# EAGLE design MiniController3HD (EAGLE 5.11)
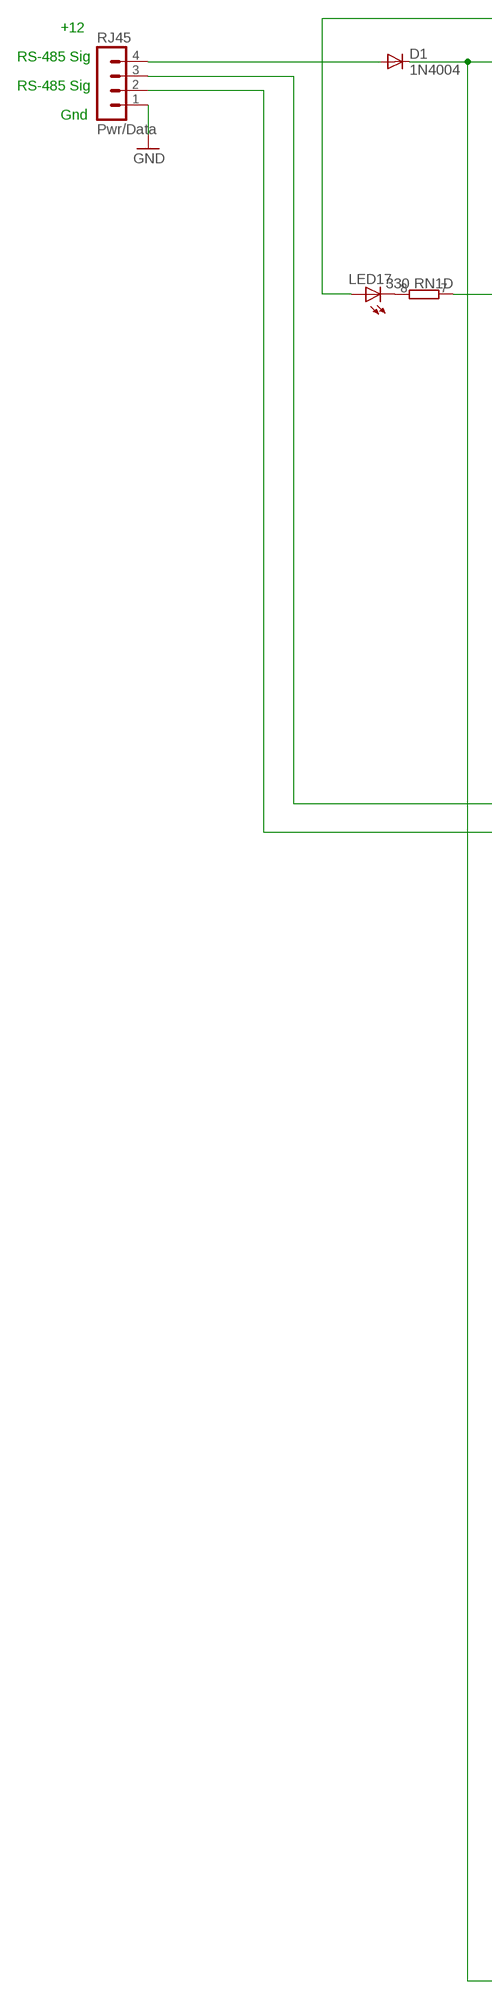
[diagram p0: schematic, sheet 1, part 1 of 2]
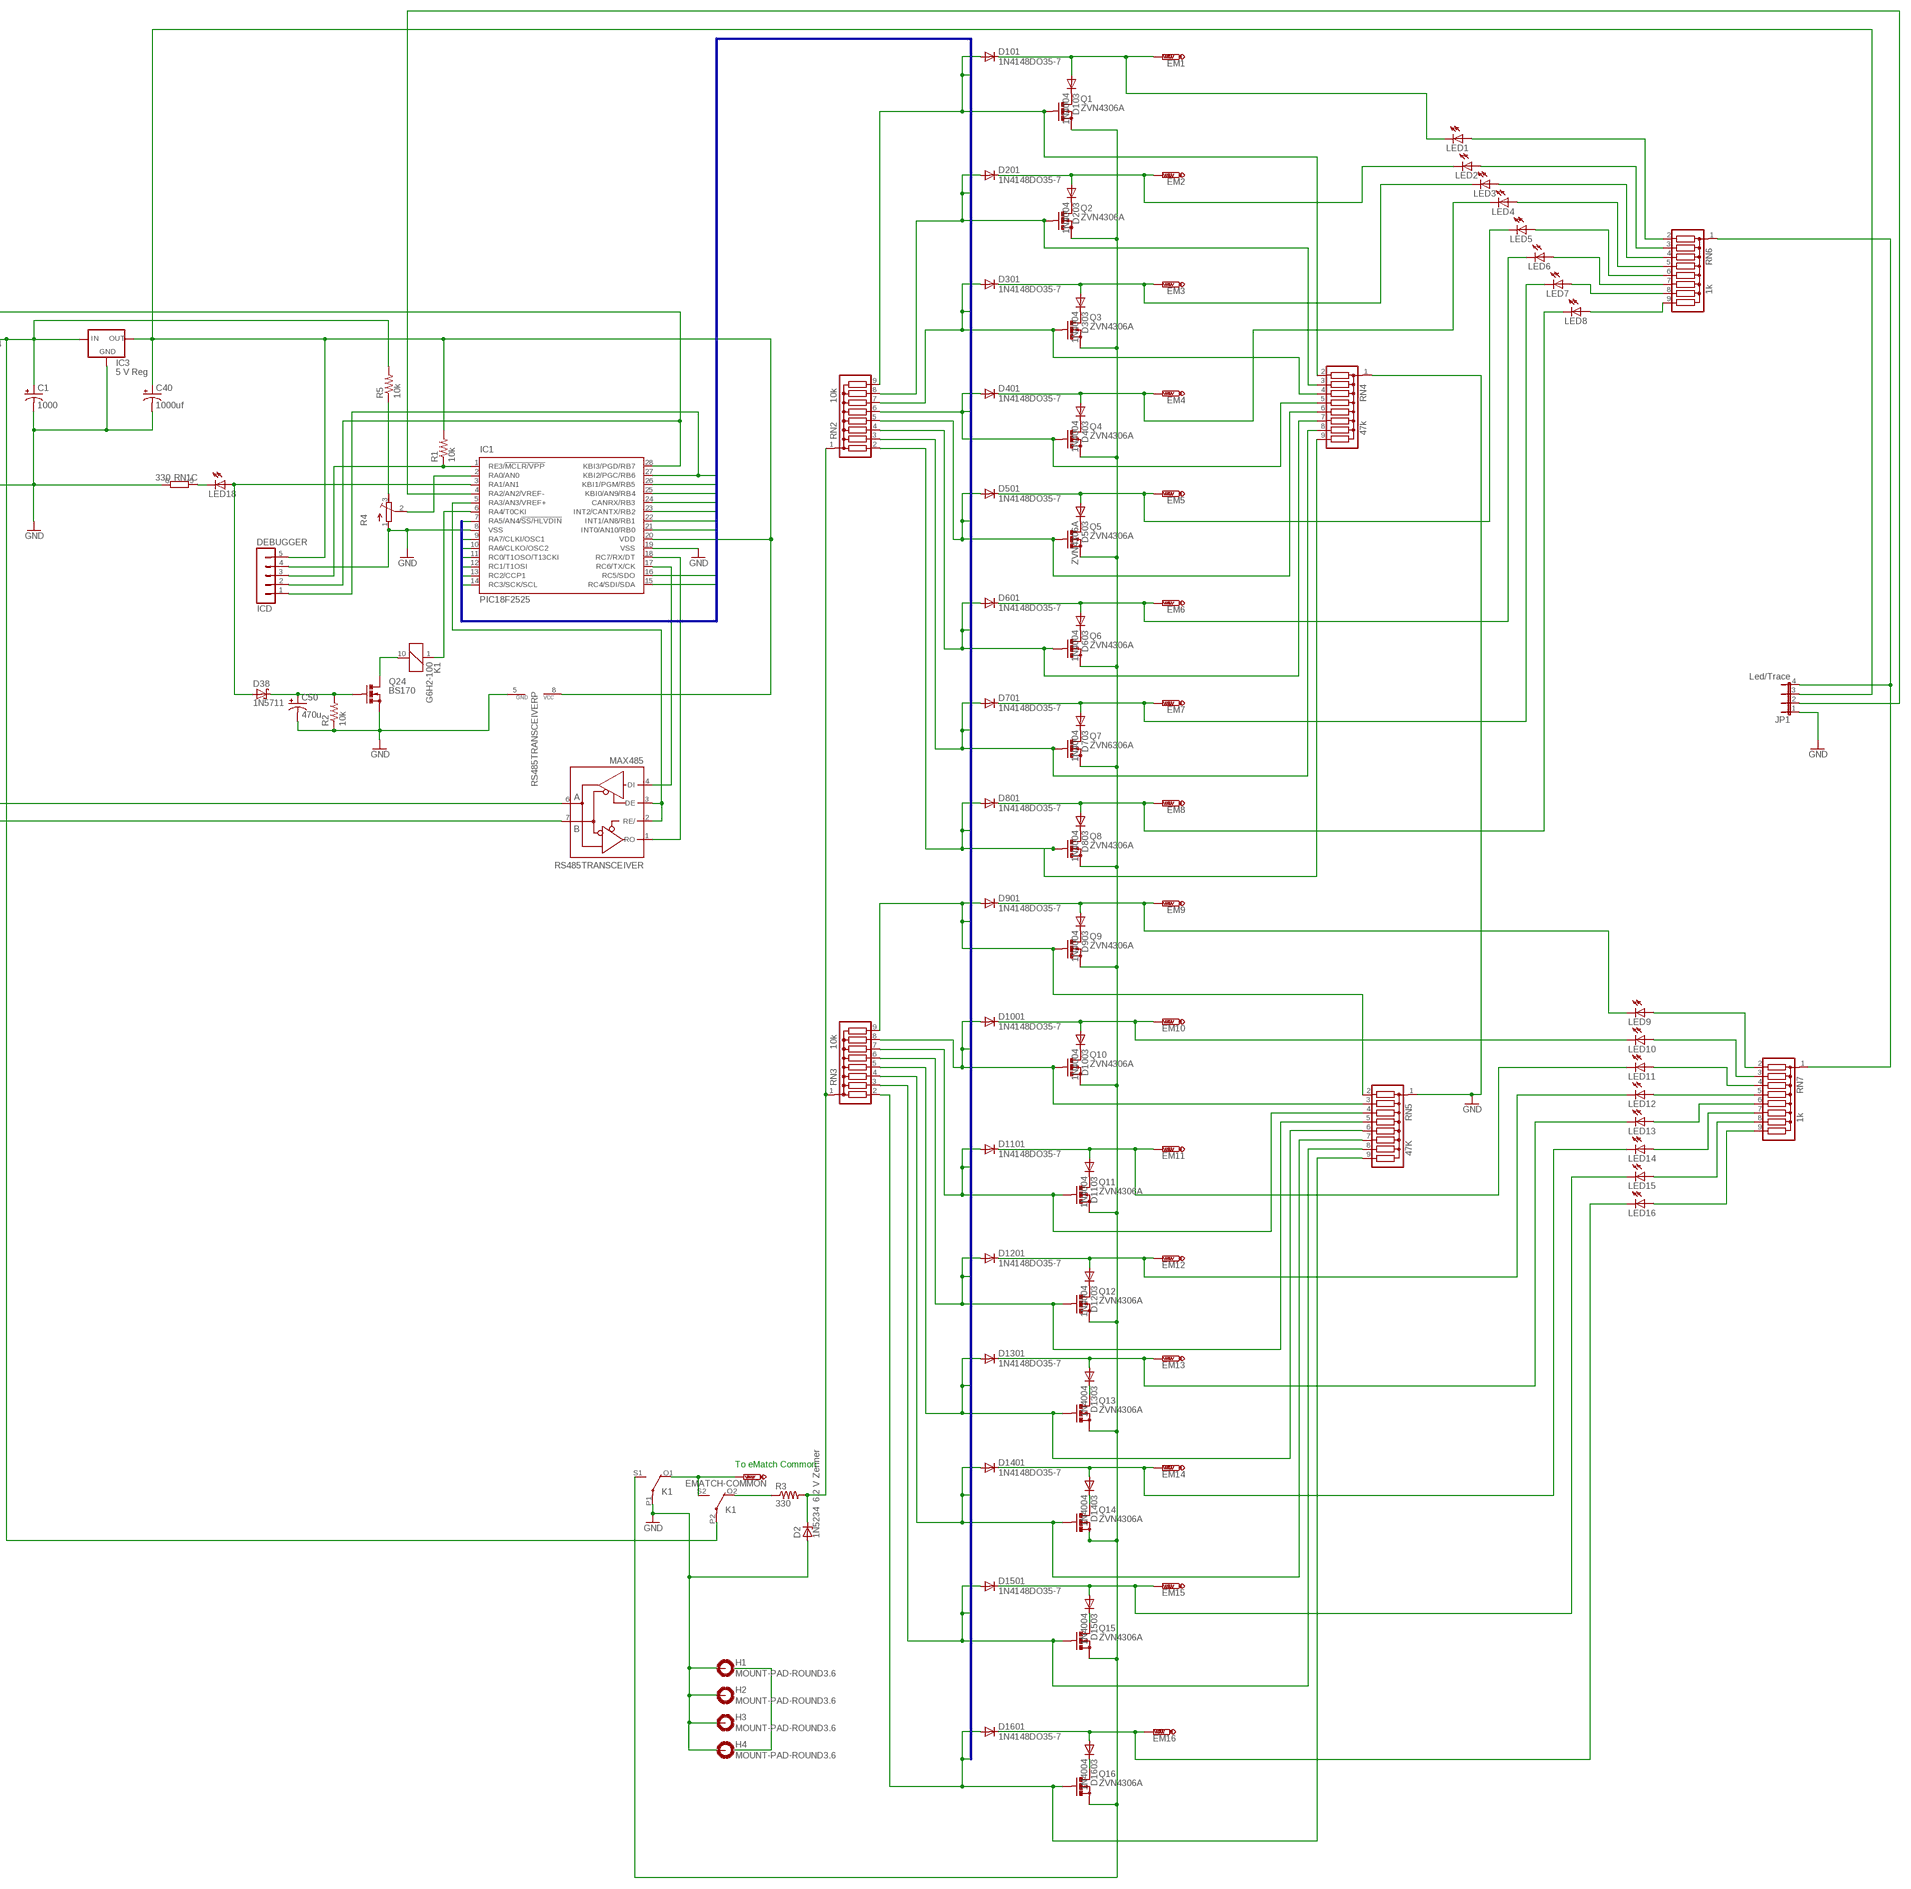
[diagram p1: schematic, sheet 1, part 2 of 2]

## Parts
C1  1000  CPOL-USE3.5-10  [E3,5-10]
C40  1000uf  CPOL-USE2.5-7  [E2,5-7]
C50  470u  CPOL-USE2.5-7  [E2,5-7]
D1  1N4004  [DO41-10]
D2  1N5234 6.2 V Zenner  1N4728  [DO41Z10]
D38  1N5711  SCHOTTKY-DIODEDO35-7  [DO35-7]
D101  1N4148DO35-7  [DO35-7]
D103  1N4004  [DO41-10]
D201  1N4148DO35-7  [DO35-7]
D203  1N4004  [DO41-10]
D301  1N4148DO35-7  [DO35-7]
D303  1N4004  [DO41-10]
D401  1N4148DO35-7  [DO35-7]
D403  1N4004  [DO41-10]
D501  1N4148DO35-7  [DO35-7]
D503  ZVN4306A  1N4004  [DO41-10]
D601  1N4148DO35-7  [DO35-7]
D603  1N4004  [DO41-10]
D701  1N4148DO35-7  [DO35-7]
D703  1N4004  [DO41-10]
D801  1N4148DO35-7  [DO35-7]
D803  1N4004  [DO41-10]
D901  1N4148DO35-7  [DO35-7]
D903  1N4004  [DO41-10]
D1001  1N4148DO35-7  [DO35-7]
D1003  1N4004  [DO41-10]
D1101  1N4148DO35-7  [DO35-7]
D1103  1N4004  [DO41-10]
D1201  1N4148DO35-7  [DO35-7]
D1203  1N4004  [DO41-10]
D1301  1N4148DO35-7  [DO35-7]
D1303  1N4004  [DO41-10]
D1401  1N4148DO35-7  [DO35-7]
D1403  1N4004  [DO41-10]
D1501  1N4148DO35-7  [DO35-7]
D1503  1N4004  [DO41-10]
D1601  1N4148DO35-7  [DO35-7]
D1603  1N4004  [DO41-10]
DEBUGGER  ICD  MA05-1  [MA05-1]
EM1  PTR1PAD1-13  [P1-13]
EM2  PTR1PAD1-13  [P1-13]
EM3  PTR1PAD1-13  [P1-13]
EM4  PTR1PAD1-13  [P1-13]
EM5  PTR1PAD1-13  [P1-13]
EM6  PTR1PAD1-13  [P1-13]
EM7  PTR1PAD1-13  [P1-13]
EM8  PTR1PAD1-13  [P1-13]
EM9  PTR1PAD1-13  [P1-13]
EM10  PTR1PAD1-13  [P1-13]
EM11  PTR1PAD1-13  [P1-13]
EM12  PTR1PAD1-13  [P1-13]
EM13  PTR1PAD1-13  [P1-13]
EM14  PTR1PAD1-13  [P1-13]
EM15  PTR1PAD1-13  [P1-13]
EM16  PTR1PAD1-13  [P1-13]
EMATCH-COMMON  PTR1PAD1-13  [P1-13]
H1  MOUNT-PAD-ROUND3.6  [3,6-PAD]
H2  MOUNT-PAD-ROUND3.6  [3,6-PAD]
H3  MOUNT-PAD-ROUND3.6  [3,6-PAD]
H4  MOUNT-PAD-ROUND3.6  [3,6-PAD]
IC1  PIC18F2525  PIC18F2580-I/SP  [DIL28-3]
IC3  5 V Reg  78LXX  [78LXX]
JP1  Led/Trace  JP4E  [JP4]
K1  G6H2-100  [G6H2-100]
LED1  LED3MM  [LED3MM]
LED2  LED3MM  [LED3MM]
LED3  LED3MM  [LED3MM]
LED4  LED3MM  [LED3MM]
LED5  LED3MM  [LED3MM]
LED6  LED3MM  [LED3MM]
LED7  LED3MM  [LED3MM]
LED8  LED3MM  [LED3MM]
LED9  LED3MM  [LED3MM]
LED10  LED3MM  [LED3MM]
LED11  LED3MM  [LED3MM]
LED12  LED3MM  [LED3MM]
LED13  LED3MM  [LED3MM]
LED14  LED3MM  [LED3MM]
LED15  LED3MM  [LED3MM]
LED16  LED3MM  [LED3MM]
LED17  LED3MM  [LED3MM]
LED18  LED3MM  [LED3MM]
Q1  ZVN4306A  BS170  [SOT54E]
Q2  ZVN4306A  BS170  [SOT54E]
Q3  ZVN4306A  BS170  [SOT54E]
Q4  ZVN4306A  BS170  [SOT54E]
Q5  ZVN4306A  BS170  [SOT54E]
Q6  ZVN4306A  BS170  [SOT54E]
Q7  ZVN6306A  BS170  [SOT54E]
Q8  ZVN4306A  BS170  [SOT54E]
Q9  ZVN4306A  BS170  [SOT54E]
Q10  ZVN4306A  BS170  [SOT54E]
Q11  ZVN4306A  BS170  [SOT54E]
Q12  ZVN4306A  BS170  [SOT54E]
Q13  ZVN4306A  BS170  [SOT54E]
Q14  ZVN4306A  BS170  [SOT54E]
Q15  ZVN4306A  BS170  [SOT54E]
Q16  ZVN4306A  BS170  [SOT54E]
Q24  BS170  [SOT54E]
R1  10k  R-US_0204/7  [0204/7]
R2  10k  R-US_0204/7  [0204/7]
R3  330  R-US_0204/7  [0204/7]
R4  R-TRIMM64W  [RTRIM64W]
R5  10k  R-US_0204/7  [0204/7]
RJ45  Pwr/Data  MA04-1  [MA04-1]
RN1  330  E4R  [SIL8]
RN2  10k  G08R  [SIL9]
RN3  10k  G08R  [SIL9]
RN4  47k  G08R  [SIL9]
RN5  47K  G08R  [SIL9]
RN6  1k  G08R  [SIL9]
RN7  1k  G08R  [SIL9]
RS485TRANSCEIVER  MAX485  MAX481CPA  [DIL08]

## Nets
CUE1: D101.A IC1.7(RA5/AN4/!SS/HLVDIN) Q1.G RN2.9 RN4.2
CUE2: D201.A IC1.9(RA7/CLKI/OSC1) Q2.G RN2.8 RN4.3
CUE3: D301.A IC1.10(RA6/CLKO/OSC2) Q3.G RN2.7 RN4.4
CUE4: D401.A IC1.11(RC0/T1OSO/T13CKI) Q4.G RN2.6 RN4.5
CUE5: D501.A IC1.12(RC1/T1OSI) Q5.G RN2.5 RN4.6
CUE6: D601.A IC1.13(RC2/CCP1) Q6.G RN2.4 RN4.7
CUE7: D701.A IC1.14(RC3/SCK/SCL) Q7.G RN2.3 RN4.8
CUE8: D801.A IC1.15(RC4/SDI/SDA) Q8.G RN2.2 RN4.9
CUE9: D901.A IC1.16(RC5/SDO) Q9.G RN3.9 RN5.2
CUE10: D1001.A IC1.21(INT0/AN10/RB0) Q10.G RN3.8 RN5.3
CUE11: D1101.A IC1.22(INT1/AN8/RB1) Q11.G RN3.7 RN5.4
CUE12: D1201.A IC1.23(INT2/CANTX/RB2) Q12.G RN3.6 RN5.5
CUE13: D1301.A IC1.24(CANRX/RB3) Q13.G RN3.5 RN5.6
CUE14: D1401.A IC1.25(KBI0/AN9/RB4) Q14.G RN3.4 RN5.7
CUE15: D1501.A IC1.26(KBI1/PGM/RB5) Q15.G RN3.3 RN5.8
CUE16: D1601.A DEBUGGER.1 IC1.27(KBI2/PGC/RB6) Q16.G RN3.2 RN5.9
GND [GND]: C1.- C40.- C50.- D2.A DEBUGGER.4 H1.B3,6(MOUNT) H2.B3,6(MOUNT) H3.B3,6(MOUNT) H4.B3,6(MOUNT) IC1.8(VSS) IC1.19(VSS) IC3.GND JP1.1 K1.P1(2:P) Q24.S R2.1 R4.1(E) RJ45.1 RN1.6 RN1.7 RN4.1 RN5.1 RS485TRANSCEIVER.5(GND)
N$1 [Pwr]: C1.+ D1.C IC3.IN K1.P2(3:P) R5.2
N$2 [GND]: K1.S1(2:S) Q1.S Q2.S Q3.S Q4.S Q5.S Q6.S Q7.S Q8.S Q9.S Q10.S Q11.S Q12.S Q13.S Q14.S Q15.S Q16.S
N$3: RJ45.3 RS485TRANSCEIVER.6(A)
N$4: RJ45.2 RS485TRANSCEIVER.7(B)
N$5: C50.+ D38.C Q24.G R2.2
N$6: IC1.18(RC7/RX/DT) RS485TRANSCEIVER.1(RO)
N$7: IC1.17(RC6/TX/CK) RS485TRANSCEIVER.4(DI)
N$8: LED17.K(C) RN1.8
N$9: IC1.6(RA4/T0CKI) K1.1
N$10 [Pwr]: D1.A RJ45.4
N$11: DEBUGGER.3 IC1.1(RE3/!MCLR/VPP) R1.1
N$12: D103.C Q1.D
N$13: LED18.K(C) RN1.5
N$14: DEBUGGER.2 IC1.28(KBI3/PGD/RB7) LED17.A
N$15: D203.C Q2.D
N$16: D303.C Q3.D
N$17: D403.C Q4.D
N$18: D503.C Q5.D
N$19: D603.C Q6.D
N$20: D703.C Q7.D
N$21: D803.C Q8.D
N$22: D903.C Q9.D
N$23: D1003.C Q10.D
N$24: D1103.C Q11.D
N$25: D1203.C Q12.D
N$26: IC1.2(RA0/AN0) R4.2(S)
N$27: IC1.4(RA2/AN2/VREF-) JP1.2
N$28: R4.3(A) R5.1
N$38: D101.C D103.A EM1.TP LED1.K(C)
N$39: D201.C D203.A EM2.TP LED2.K(C)
N$40: D301.C D303.A EM3.TP LED3.K(C)
N$41: D401.C D403.A EM4.TP LED4.K(C)
N$42: D501.C D503.A EM5.TP LED5.K(C)
N$43: D601.C D603.A EM6.TP LED6.K(C)
N$44: D701.C D703.A EM7.TP LED7.K(C)
N$45: D801.C D803.A EM8.TP LED8.K(C)
N$46: D901.C D903.A EM9.TP LED9.K(C)
N$47: D1001.C D1003.A EM10.TP LED10.K(C)
N$48: D1101.C D1103.A EM11.TP LED11.K(C)
N$49: K1.O2(3:O) R3.1
N$50: K1.10 Q24.D
N$51 [Pwr]: EMATCH-COMMON.TP K1.O1(2:O) K1.S2(3:S)
N$53: IC1.5(RA3/AN3/VREF+) RS485TRANSCEIVER.2(RE/) RS485TRANSCEIVER.3(DE)
N$54: D1303.C Q13.D
N$55: D1403.C Q14.D
N$56: D1503.C Q15.D
N$57: D1603.C Q16.D
N$62: D1601.C D1603.A EM16.TP LED16.K(C)
N$63: LED8.A RN6.9
N$64: LED7.A RN6.8
N$65: D38.A IC1.3(RA1/AN1) LED18.A
N$67: LED6.A RN6.7
N$68: LED5.A RN6.6
N$69: LED4.A RN6.5
N$70: LED3.A RN6.4
N$71: LED2.A RN6.3
N$72: LED1.A RN6.2
N$73: D2.C R3.2 RN2.1 RN3.1
N$74: D1501.C D1503.A EM15.TP LED15.K(C)
N$75: LED9.A RN7.2
N$76: LED10.A RN7.3
N$77: LED11.A RN7.4
N$78: LED12.A RN7.5
N$79: LED13.A RN7.6
N$80: LED14.A RN7.7
N$81: LED15.A RN7.8
N$82: LED16.A RN7.9
N$83: JP1.4 RN6.1 RN7.1
N$84: D1301.C D1303.A EM13.TP LED13.K(C)
N$85: D1401.C D1403.A EM14.TP LED14.K(C)
N$86: D1201.C D1203.A EM12.TP LED12.K(C)
VDD: C40.+ DEBUGGER.5 IC1.20(VDD) IC3.OUT JP1.3 R1.2 RS485TRANSCEIVER.8(VCC)
Unconnected: RN1.1 RN1.2 RN1.3 RN1.4

## Buses
CUE[1..16]

## Notes on the sheet
- +12
- RS-485 Sig
- RS-485 Sig
- Gnd
- To eMatch Common

## Library data of the parts
C1 C40 C50 = rcl:CPOL-US: POLARIZED CAPACITOR, American symbol
D1 D103 D203 D303 D403 D503 D603 D703 D803 D903 D1003 D1103 D1203 D1303 D1403 D1503 D1603 = diode:1N4004: DIODE general purpose rectifier, 1 A
D2 = diode:1N4728: Z DIODE 3.3 V, 1W, 5 percent
D38 = diode:SCHOTTKY-DIODE: Schottky Diode
D101 D201 D301 D401 D501 D601 D701 D801 D901 D1001 D1101 D1201 D1301 D1401 D1501 D1601 = diode:1N4148: DIODE high speed (Philips)
DEBUGGER = con-lstb:MA05-1: PIN HEADER; OC_FARNELL: unknown; OC_NEWARK: unknown
EM1-EM16 EMATCH-COMMON = testpad:PTR1: TEST PIN
H1-H4 = holes:MOUNT-PAD-ROUND: MOUNTING PAD, round
IC1 = microchip:PIC18F2*80: 28-Pin Enhanced Flash Microcontrollers with ECAN(TM) Technology 10-Bit A/D and nanoWatt Technology Source: http://www.microchip.com .. 39637a.pdf
IC3 = v-reg:78LXX: VOLTAGE REGULATOR
JP1 = jumper:JP4E: JUMPER
K1 = Cranwell:G6H2-100: RELAY 2 x switch, 0.5 A/125 V AC, 1 A/30 V DC, Omron
LED1-LED18 = led:LED: LED OSRAM: - CHIPLED LG R971, LG N971, LY N971, LG Q971, LY Q971, LO R971, LY R971 LH N974, LH R974 LS Q976, LO Q976, LY Q976 LO Q996 - Hyper CHIPLED LW Q18S LB Q993, LB Q99A, LB R99A - SideLED LS A670, LO A670, LY A670, LG A670, LP A670 LB A673, LV A673, LT A673, LW A673 LH A674 LY A675 LS A676, LA A676, LO A676, LY A676, LW A676 LS A679, LY A679, LG A679 - Hyper Micro SIDELED® LS Y876, LA Y876, LO Y876, LY Y876 LT Y87S - SmartLED LW L88C, LW L88S LB L89C, LB L89S, LG L890 LS L89K, LO L89K, LY L89K LS L896, LA L896, LO L896, LY L896 - TOPLED LS T670, LO T670, LY T670, LG T670, LP T670 LSG T670, LSP T670, LSY T670, LOP T670, LYG T670 LG T671, LOG T671, LSG T671 LB T673, LV T673, LT T673, LW T673 LH T674 LS T676, LA T676, LO T676, LY T676, LB T676, LH T676, LSB T676, LW T676 LB T67C, LV T67C, LT T67C, LS T67K, LO T67K, LY T67K, LW E67C LS E67B, LA E67B, LO E67B, LY E67B, LB E67C, LV E67C, LT E67C LW T67C LS T679, LY T679, LG T679 LS T770, LO T770, LY T770, LG T770, LP T770 LB T773, LV T773, LT T773, LW T773 LH T774 LS E675, LA E675, LY E675, LS T675 LS T776, LA T776, LO T776, LY T776, LB T776 LHGB T686 LT T68C, LB T68C - Hyper Mini TOPLED® LB M676 - Mini TOPLED Santana® LG M470 LS M47K, LO M47K, LY M47K Source: http://www.osram.convergy.de LUXEON: - LUMILED® LXK2-PW12-R00, LXK2-PW12-S00, LXK2-PW14-U00, LXK2-PW14-V00 LXK2-PM12-R00, LXK2-PM12-S00, LXK2-PM14-U00 LXK2-PE12-Q00, LXK2-PE12-R00, LXK2-PE12-S00, LXK2-PE14-T00, LXK2-PE14-U00 LXK2-PB12-K00, LXK2-PB12-L00, LXK2-PB12-M00, LXK2-PB14-N00, LXK2-PB14-P00, LXK2-PB14-Q00 LXK2-PR12-L00, LXK2-PR12-M00, LXK2-PR14-Q00, LXK2-PR14-R00 LXK2-PD12-Q00, LXK2-PD12-R00, LXK2-PD12-S00 LXK2-PH12-R00, LXK2-PH12-S00 LXK2-PL12-P00, LXK2-PL12-Q00, LXK2-PL12-R00 Source: www.luxeon.com KINGBRIGHT: KA-3528ASYC Source: www.kingbright.com
Q1-Q16 Q24 = transistor-small-signal:BS170: N-CHANNEL MOS FET
R1-R3 R5 = rcl:R-US_: RESISTOR, American symbol
R4 = rcl:R-TRIMM: Trimm resistor
RJ45 = con-lstb:MA04-1: PIN HEADER
RN1 = resistor-sil:E4R: SIL RESISTOR
RN2-RN7 = resistor-sil:G08R: SIL RESISTOR
RS485TRANSCEIVER = maxim:MAX481CPA: RS485 TRANSEIVER

## Net classes
1 GND: width 0.61 mm
2 Pwr: width 0.61 mm

## Board
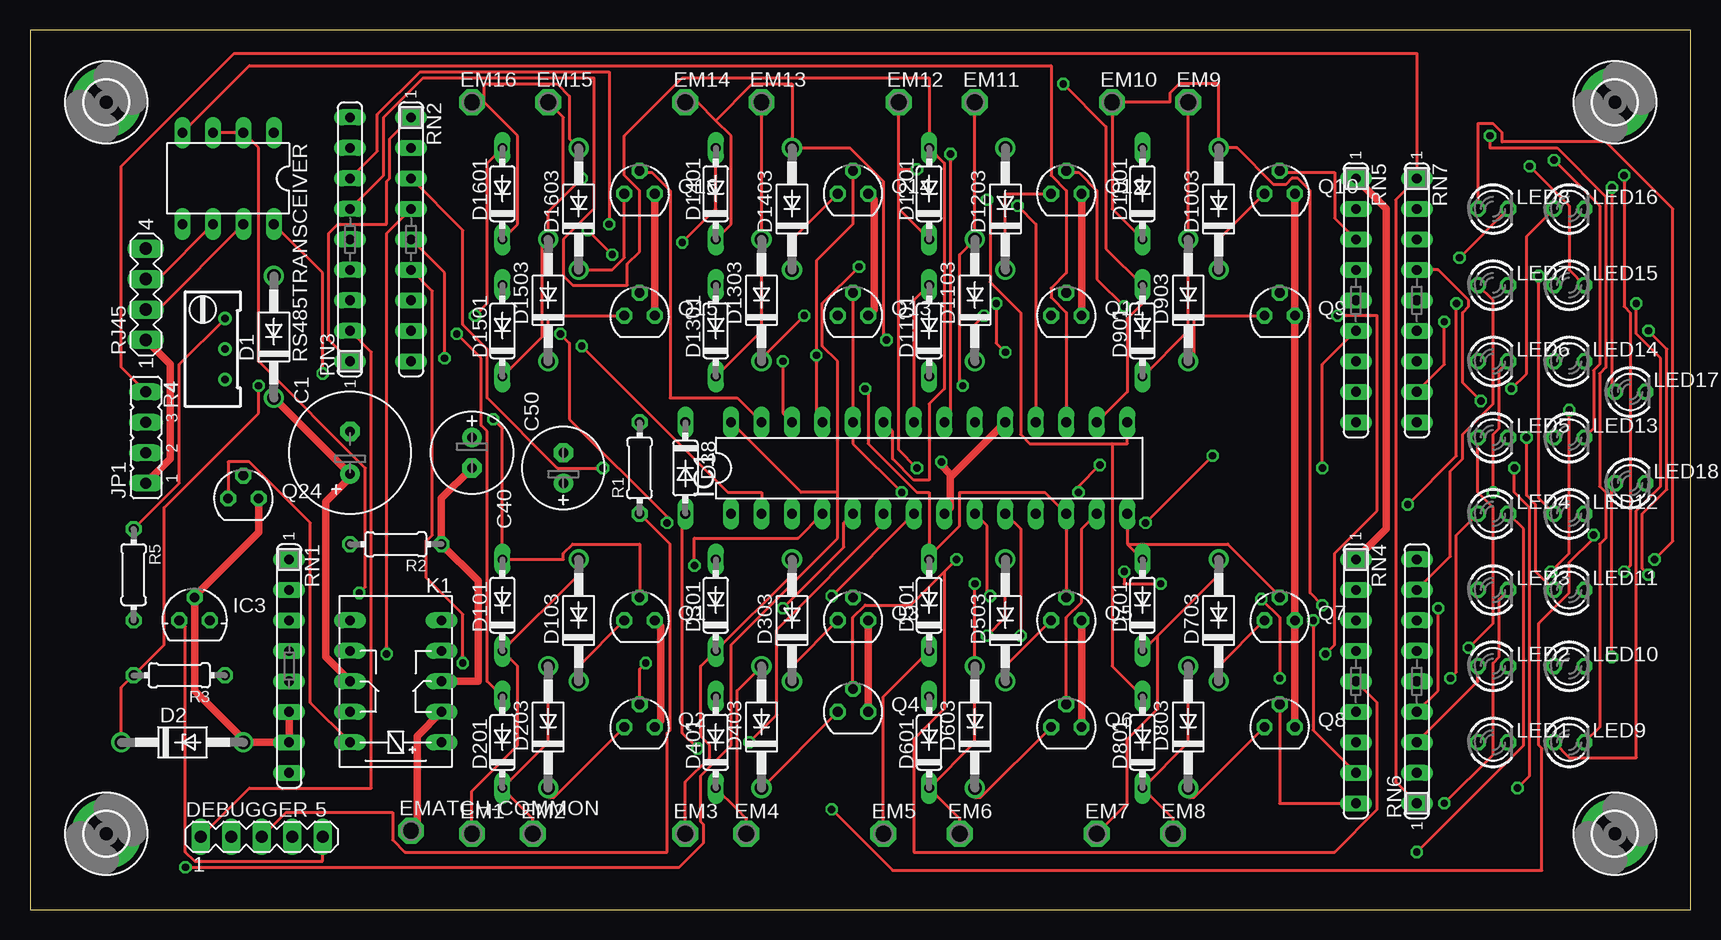
[diagram p2: board, top side]
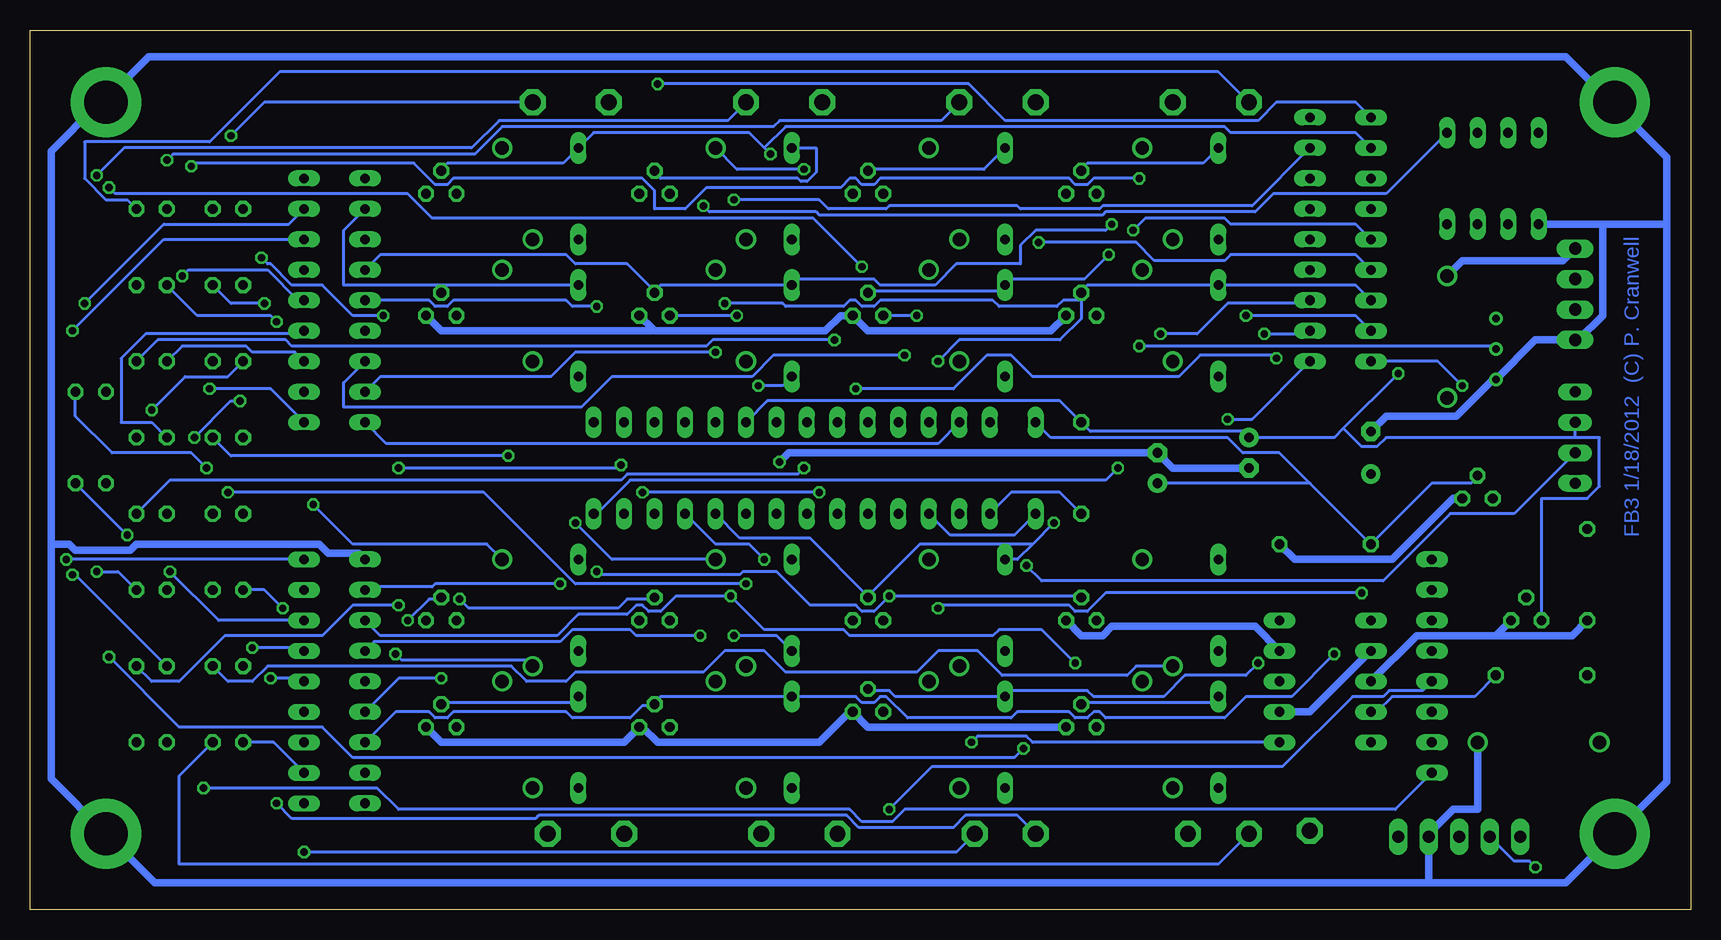
[diagram p3: board, bottom side, seen from below]

Size 138.41 x 73.33 mm. Coordinates in mm from the lower left corner, seen from the top.
Outline: 0,0 138.41,0 138.41,73.33 0,73.33 0,0
Copper layers (1*16): Top 0.035mm / dielectric 1.5mm / Bottom 0.035mm
Design rules "default *": minimum track width 10mil, minimum drill 24mil, track to track 10mil, track to pad 10mil, pad to pad 10mil, via to via 10mil, smd to smd 8mil, copper to edge 40mil, drill to drill 10mil, minimum pad ring 10mil, minimum via ring 8mil, stop-mask expansion 4mil, vias tented up to drill 0mil, thermal gap 10mil

### Footprints (pad centres in the part's own frame; a part is rotated, then mirrored left to right if it is on the bottom)
E3,5-10 = drill 0.813 pad 1.6 round: + -1.778,0 | drill 0.813 pad 1.6 octagon: - 1.778,0
E2,5-7 = drill 0.813 pad 1.6 round: + -1.27,0 | drill 0.813 pad 1.6 octagon: - 1.27,0
DO41-10 = drill 1.118 round: A 5.08,0; C -5.08,0
DO41Z10 = drill 1.118 round: A 5.08,0; C -5.08,0
DO35-7 = drill 0.813 long: A 3.81,0; C -3.81,0
MA05-1 = drill 1.016 long: 1 -5.08,0; 2 -2.54,0; 3 0,0; 4 2.54,0; 5 5.08,0
P1-13 = drill 1.321 pad 2.159 octagon: TP 0,0
3,6-PAD = drill 3.6 pad 5.842 round: B3,6 0,0
DIL28-3 = drill 0.813 long: 1 -16.51,-3.81; 2 -13.97,-3.81; 3 -11.43,-3.81; 4 -8.89,-3.81; 5 -6.35,-3.81; 6 -3.81,-3.81; 7 -1.27,-3.81; 8 1.27,-3.81; 9 3.81,-3.81; 10 6.35,-3.81; 11 8.89,-3.81; 12 11.43,-3.81; 13 13.97,-3.81; 14 16.51,-3.81; 15 16.51,3.81; 16 13.97,3.81; 17 11.43,3.81; 18 8.89,3.81; 19 6.35,3.81; 20 3.81,3.81; 21 1.27,3.81; 22 -1.27,3.81; 23 -3.81,3.81; 24 -6.35,3.81; 25 -8.89,3.81; 26 -11.43,3.81; 27 -13.97,3.81; 28 -16.51,3.81
78LXX = drill 0.813 octagon: GND 0,1.905; IN 1.27,0; OUT -1.27,0
JP4 = drill 0.914 long: 1 -3.81,0; 2 -1.27,0; 3 1.27,0; 4 3.81,0
G6H2-100 = drill 0.813 long: 1 -5.08,-3.81; 5 5.08,-3.81; 6 5.08,3.81; 10 -5.08,3.81; O1 -2.54,-3.81; O2 -2.54,3.81; P1 0,-3.81; P2 0,3.81; S1 2.54,-3.81; S2 2.54,3.81
LED3MM = drill 0.813 octagon: A -1.27,0; K 1.27,0
SOT54E = drill 0.813 octagon: D -1.27,0; G 0,1.905; S 1.27,0
0204/7 = drill 0.813 octagon: 1 -3.81,0; 2 3.81,0
RTRIM64W = drill 0.61 round: 1 1.27,-2.54; 2 1.27,0; 3 1.27,2.54
MA04-1 = drill 1.016 long: 1 -3.81,0; 2 -1.27,0; 3 1.27,0; 4 3.81,0
SIL8 = drill 0.813 long: 1 -8.89,0; 2 -6.35,0; 3 -3.81,0; 4 -1.27,0; 5 1.27,0; 6 3.81,0; 7 6.35,0; 8 8.89,0
SIL9 = drill 0.813 long: 1 -10.16,0; 2 -7.62,0; 3 -5.08,0; 4 -2.54,0; 5 0,0; 6 2.54,0; 7 5.08,0; 8 7.62,0; 9 10.16,0
DIL08 = drill 0.813 long: 1 -3.81,-3.81; 2 -1.27,-3.81; 3 1.27,-3.81; 4 3.81,-3.81; 5 3.81,3.81; 6 1.27,3.81; 7 -1.27,3.81; 8 -3.81,3.81

### Placement (x,y rotation side)
C1  26.67,38.1 90 top
C40  36.83,38.1 270 top
C50  44.45,36.83 90 top
D1  20.32,47.75 90 top
D2  12.7,13.97 0 top
D38  54.61,36.83 270 top
D101  39.37,25.4 90 top
D103  45.72,24.13 90 top
D201  39.37,13.97 90 top
D203  43.18,15.24 90 top
D301  57.15,25.4 90 top
D303  63.5,24.13 90 top
D401  57.15,13.97 90 top
D403  60.96,15.24 90 top
D501  74.93,25.4 90 top
D503  81.28,24.13 90 top
D601  74.93,13.97 90 top
D603  78.74,15.24 90 top
D701  92.71,25.4 90 top
D703  99.06,24.13 90 top
D801  92.71,13.97 90 top
D803  96.52,15.24 90 top
D901  92.71,48.26 90 top
D903  96.52,50.8 90 top
D1001  92.71,59.69 90 top
D1003  99.06,58.42 90 top
D1101  74.93,48.26 90 top
D1103  78.74,50.8 90 top
D1201  74.93,59.69 90 top
D1203  81.28,58.42 90 top
D1301  57.15,48.26 90 top
D1303  60.96,50.8 90 top
D1401  57.15,59.69 90 top
D1403  63.5,58.42 90 top
D1501  39.37,48.26 90 top
D1503  43.18,50.8 90 top
D1601  39.37,59.69 90 top
D1603  45.72,58.42 90 top
DEBUGGER  19.3,6.1 0 top
EM1  36.83,6.35 0 top
EM2  41.91,6.35 0 top
EM3  54.61,6.35 0 top
EM4  59.69,6.35 0 top
EM5  71.12,6.35 0 top
EM6  77.47,6.35 0 top
EM7  88.9,6.35 0 top
EM8  95.25,6.35 0 top
EM9  96.52,67.31 0 top
EM10  90.17,67.31 0 top
EM11  78.74,67.31 0 top
EM12  72.39,67.31 0 top
EM13  60.96,67.31 0 top
EM14  54.61,67.31 0 top
EM15  43.18,67.31 0 top
EM16  36.83,67.31 0 top
EMATCH-COMMON  31.75,6.6 0 top
H1  6.35,6.35 0 top
H2  6.35,67.31 0 top
H3  132.08,67.31 0 top
H4  132.08,6.35 0 top
IC1  74.93,36.83 0 top
IC3  13.72,24.13 0 top
JP1  9.65,39.37 90 top
K1  30.48,19.05 90 top
LED1  121.92,13.97 0 top
LED2  121.92,20.32 0 top
LED3  121.92,26.67 0 top
LED4  121.92,33.02 0 top
LED5  121.92,39.37 0 top
LED6  121.92,45.72 0 top
LED7  121.92,52.07 0 top
LED8  121.92,58.42 0 top
LED9  128.27,13.97 0 top
LED10  128.27,20.32 0 top
LED11  128.27,26.67 0 top
LED12  128.27,33.02 0 top
LED13  128.27,39.37 0 top
LED14  128.27,45.72 0 top
LED15  128.27,52.07 0 top
LED16  128.27,58.42 0 top
LED17  133.35,43.18 0 top
LED18  133.35,35.56 0 top
Q1  50.8,24.13 0 top
Q2  50.8,15.24 0 top
Q3  68.58,24.13 0 top
Q4  68.58,16.51 0 top
Q5  86.36,24.13 0 top
Q6  86.36,15.24 0 top
Q7  104.14,24.13 0 top
Q8  104.14,15.24 0 top
Q9  104.14,49.53 0 top
Q10  104.14,59.69 0 top
Q11  86.36,49.53 0 top
Q12  86.36,59.69 0 top
Q13  68.58,49.53 0 top
Q14  68.58,59.69 0 top
Q15  50.8,49.53 0 top
Q16  50.8,59.69 0 top
Q24  17.78,34.29 0 top
R1  50.8,36.83 90 top
R2  30.48,30.48 180 top
R3  12.45,19.56 180 top
R4  14.99,46.74 0 top
R5  8.64,27.94 270 top
RJ45  9.65,51.31 90 top
RN1  21.59,20.32 270 top
RN2  31.75,55.88 270 top
RN3  26.67,55.88 90 top
RN4  110.49,19.05 270 top
RN5  110.49,50.8 270 top
RN6  115.57,19.05 90 top
RN7  115.57,50.8 270 top
RS485TRANSCEIVER  16.51,60.96 180 top

### Tracks (layer width: path | path; a pad name or v marks a point on that pad's centre or on a via)
CUE1  (via drill 0.61)
  Top 0.254: Q1.G 50.8,30.48 45.21,30.48 44.45,29.72 44.45,29.21 D101.A 39.37,40.13 v38.61,40.89 | v66.8,26.16 IC1.7 | v94.23,27.18 91.19,27.18 v91.19,28.19
  Bottom 0.254: RN2.9 36.58,40.89 v38.61,40.89 | Q1.G 50.8,26.16 v66.8,26.16 68.07,24.89 69.09,24.89 69.6,25.4 73.41,25.4 76.2,28.19 78.99,28.19 79.25,27.94 90.93,27.94 v91.19,28.19 | RN4.2 110.24,26.92 104.9,26.92 104.65,27.18 v94.23,27.18
CUE2  (via drill 0.61)
  Top 0.254: v80.01,26.16 79.76,26.42 79.76,32 IC1.9 | v35.56,48.01 37.59,45.97 37.59,40.39 38.1,39.88 38.1,19.05 D201.A | v51.31,20.57 50.8,20.07 Q2.G
  Bottom 0.254: RN4.3 109.22,22.86 94.49,22.86 92.71,24.64 88.65,24.64 87.88,25.4 87.38,25.4 86.87,24.89 85.85,24.89 84.58,26.16 v80.01,26.16 77.22,23.37 70.61,23.37 70.1,22.86 58.17,22.86 57.66,23.37 54.1,23.37 v51.31,20.57 | D201.A 39.88,17.27 50.8,17.27 Q2.G | RN2.8 32,48.01 v35.56,48.01
CUE3  (via drill 0.61)
  Top 0.254: v44.2,48.01 44.96,47.24 44.96,40.89 53.09,32.77 v53.09,32.26 | v82.55,22.86 82.55,31.75 IC1.10
  Bottom 0.254: RN2.7 32,50.55 38.61,50.55 41.15,48.01 v44.2,48.01 | 54.86,30.48 56.13,29.21 D301.A | v53.09,32.26 54.86,30.48 | 68.58,26.16 64.26,30.48 54.86,30.48 | IC1.10 79.25,30.99 73.41,30.99 68.58,26.16 | 68.58,26.16 Q3.G | RN4.4 109.73,22.35 94.23,22.35 93.22,23.37 88.39,23.37 87.88,22.86 v82.55,22.86
CUE4  (via drill 0.61)
  Top 0.254: RN2.6 33.53,51.56 33.53,31.24 33.02,30.73 33.02,27.69 36.07,24.64 v36.07,20.57 | 76.2,28.19 73.41,25.4 69.6,25.4 68.58,24.38 Q4.G | 76.2,28.19 v77.22,29.21 | RN4.5 112.27,17.27 112.27,8.38 108.71,4.83 73.66,4.83 73.66,14.22 76.2,16.76 76.2,28.19
  Bottom 0.254: Q4.G 68.58,18.29 66.8,18.29 66.29,17.78 D401.A 56.64,18.29 50.29,18.29 49.78,17.78 43.94,17.78 42.16,19.56 37.08,19.56 v36.07,20.57 | IC1.11 81.28,30.48 78.49,30.48 v77.22,29.21
CUE5  (via drill 0.61)
  Top 0.254: Q5.G IC1.12 84.58,34.8 77.47,34.8 77.47,32 74.93,29.46 | v104.14,19.3 104.14,24.38 v102.62,25.91 | RN2.5 34.54,53.09 v34.54,45.97 | v69.6,43.43 69.85,43.18 69.85,38.86 73.91,34.8 74.93,34.8 74.93,29.46 | 74.93,29.46 D501.A
  Bottom 0.254: RN4.6 107.7,19.3 v104.14,19.3 | v102.62,25.91 101.85,25.15 89.41,25.15 88.65,25.91 86.36,25.91 Q5.G | v34.54,45.97 34.8,46.23 40.89,46.23 42.67,44.45 54.86,44.45 56.64,46.23 58.67,46.23 61.47,43.43 v69.6,43.43
CUE6  (via drill 0.61)
  Top 0.254: RN2.4 29.72,56.39 v29.72,21.34 | IC1.13 87.63,31.75 87.63,25.65 86.36,24.38 Q6.G
  Bottom 0.254: v29.72,21.34 33.27,17.78 37.08,17.78 38.86,16 48.77,16 49.28,16.51 49.78,16.51 50.29,16 51.31,16 51.82,16.51 56.13,16.51 56.64,16 65.28,16 67.06,17.78 67.56,17.78 68.07,17.27 69.09,17.27 69.6,17.78 D601.A 85.85,17.78 86.36,17.27 Q6.G 86.36,17.02 87.38,17.02 88.39,16 93.22,16 93.73,16.51 103.12,16.51 103.63,16 104.65,16 105.16,16.51 107.95,16.51 RN4.7
CUE7  (via drill 0.61)
  Top 0.254: RN2.3 36.07,56.64 36.07,48.77 38.1,46.74 38.1,42.67 43.94,36.83 v47.75,36.83 | 91.44,30.48 D701.A | IC1.14 91.44,30.48 | 91.44,30.48 99.82,30.48 104.14,26.16 Q7.G | RN4.8 106.93,14.99 v106.93,24.13
  Bottom 0.254: v47.75,36.83 48.77,35.81 88.39,35.81 91.19,33.02 IC1.14 | v106.93,24.13 105.16,25.91 104.14,25.91 Q7.G
CUE8  (via drill 0.61)
  Top 0.254: RN4.9 104.14,8.89 Q8.G | v79.76,59.18 80.01,58.93 80.01,52.32 82.55,49.78 82.55,39.62 83.31,38.86 90.17,38.86 | 90.17,38.86 91.44,38.86 IC1.15 | D801.A 90.17,20.32 90.17,38.86
  Bottom 0.254: D801.A 93.22,17.27 104.14,17.27 Q8.G | RN2.2 36.58,58.67 49.02,58.67 49.28,58.42 55.88,58.42 56.13,58.67 66.8,58.67 67.06,58.42 71.88,58.42 72.64,59.18 v79.76,59.18
CUE9  (via drill 0.61)
  Top 0.254: v86.11,68.83 89.66,65.28 89.66,55.12 D901.A 92.71,50.55 91.44,49.28 91.44,43.18 IC1.16
  Bottom 0.254: RN3.9 27.94,67.31 34.54,67.31 36.07,65.79 57.15,65.79 60.2,68.83 v86.11,68.83 | 103.63,52.07 104.14,51.56 Q9.G | D901.A 103.63,52.07 | RN5.2 112.27,56.64 112.27,52.07 103.63,52.07
CUE10  (via drill 0.61)
  Top 0.254: RN5.3 108.71,57.66 108.71,61.47 104.14,61.47 Q10.G | IC1.21 76.71,41.15 v76.71,62.99
  Bottom 0.254: 77.22,63.5 78.49,64.77 91.44,64.77 D1001.A 93.98,62.23 103.63,62.23 104.14,61.72 Q10.G | 77.22,63.5 v76.71,62.99 | RN3.8 27.94,64.77 38.35,64.77 38.86,65.28 75.44,65.28 77.22,63.5
CUE11  (via drill 0.61)
  Top 0.254: RN3.7 28.96,63.25 28.96,66.29 32.51,69.85 48.26,69.85 v48.26,57.15 | IC1.22 73.66,50.8 D1101.A
  Bottom 0.254: v48.26,57.15 48.77,56.64 54.61,56.64 55.88,55.37 55.88,53.85 61.21,53.85 62.99,52.07 67.56,52.07 68.07,52.58 74.42,52.58 D1101.A 85.85,52.07 86.36,51.56 | RN5.4 109.22,54.61 93.73,54.61 92.96,53.85 88.65,53.85 86.36,51.56 | 86.36,51.56 Q11.G
CUE12  (via drill 0.61)
  Top 0.254: RN3.6 29.46,61.21 29.46,66.04 32.77,69.34 46.99,69.34 46.99,58.42 44.45,55.88 44.45,52.83 45.21,52.07 49.78,52.07 49.78,53.85 50.8,54.86 50.8,59.94 49.53,61.21 49.53,64.52 54.36,69.34 74.93,69.34 D1201.A 76.2,62.23 76.2,43.43 74.93,42.16 74.93,35.81 73.66,35.81 71.88,37.59 71.88,39.88 IC1.23 | v91.19,50.29 88.9,52.58 88.9,59.94 87.38,61.47 86.36,61.47 Q12.G
  Bottom 0.254: D1201.A 72.9,63.5 72.9,61.47 73.66,60.71 74.17,60.71 74.42,60.96 85.85,60.96 86.36,61.47 Q12.G | RN5.5 105.16,50.8 104.65,50.29 103.63,50.29 103.12,50.8 93.73,50.8 93.22,50.29 v91.19,50.29
CUE13  (via drill 0.61)
  Top 0.254: Q13.G IC1.24 68.58,38.86 v72.64,34.8 | RN5.6 107.7,45.47 v107.7,36.83 | v89.15,37.08 87.38,35.31 v87.38,34.8 | v46.48,56.64 v48.51,54.61
  Bottom 0.254: v107.7,36.83 89.41,36.83 v89.15,37.08 | v72.64,34.8 v87.38,34.8 | Q13.G 68.58,51.56 57.66,51.56 D1301.A 56.64,52.58 50.55,52.58 v48.51,54.61 | RN3.5 27.94,57.15 38.35,57.15 38.86,57.66 45.47,57.66 v46.48,56.64
CUE14  (via drill 0.61)
  Top 0.254: v54.36,55.63 57.15,58.42 D1401.A | IC1.25 65.53,41.15 v65.53,46.23 65.53,54.1 68.58,57.15 Q14.G
  Bottom 0.254: RN3.4 27.94,54.61 38.35,54.61 38.86,54.1 44.7,54.1 46.23,55.63 v54.36,55.63 | RN5.7 112.27,43.94 112.27,41.91 92.46,41.91 89.92,44.45 78.23,44.45 76.45,46.23 v65.53,46.23 | D1401.A 58.93,61.72 68.58,61.72 Q14.G
CUE15  (via drill 0.61)
  Top 0.254: IC1.26 62.74,41.4 v62.74,45.72 | v81.28,46.48 80.52,47.24 v80.52,50.55
  Bottom 0.254: RN3.3 27.94,52.07 D1501.A 50.29,52.07 50.8,51.56 Q15.G | v62.74,45.72 60.96,47.5 52.58,47.5 50.8,49.28 50.8,50.8 | Q15.G 50.8,50.8 | RN5.8 109.22,44.45 95,44.45 92.96,46.48 v81.28,46.48 | v80.52,50.55 75.69,50.55 75.44,50.29 70.61,50.29 70.1,50.8 69.6,50.8 69.09,50.29 68.07,50.29 67.56,50.8 58.17,50.8 57.66,50.29 52.83,50.29 52.32,50.8 50.8,50.8 | Q15.G 50.8,51.31
CUE16  (via drill 0.61)
  Top 0.254: v37.08,49.53 38.1,50.55 38.1,62.23 D1601.A | IC1.27 58.93,42.67 53.34,42.67 53.34,59.94 51.82,61.47 50.8,61.47 Q16.G | DEBUGGER.1 18.29,10.16 28.45,10.16 28.45,46.48 RN3.2
  Bottom 0.254: RN3.2 27.94,49.53 v37.08,49.53 | D1601.A 40.64,62.23 50.29,62.23 50.8,61.72 Q16.G | RN5.9 108.71,38.86 62.74,38.86 IC1.27
GND  (via drill 0.61)
  Top 0.61: IC1.8 76.71,33.53 76.71,36.07 | 76.71,36.07 IC1.19 | K1.P1 37.34,19.05 37.34,27.43 R2.1 34.29,34.29 C40.- | v75.95,37.34 75.95,37.08 76.71,36.32 76.71,36.07 | JP1.1 11.68,37.59 11.68,45.47 RJ45.1 | RN1.6 RN1.7 D2.A 17.78,14.22 13.72,18.29 IC3.GND 13.72,26.16 19.05,31.5 Q24.S | RN5.1 113.03,58.42 113.03,31.75 RN4.1
  Bottom 0.61: 6.6,67.31 H2.B3,6 | 6.6,67.31 10.41,71.12 128.52,71.12 132.21,67.44 | 132.21,67.44 132.59,67.06 132.84,67.06 136.65,63.25 136.65,30.48 | 136.65,30.48 136.65,10.92 H4.B3,6 128.02,2.29 21.84,2.29 | 21.84,2.29 10.41,2.29 H1.B3,6 2.03,10.67 2.03,57.15 | 6.6,67.31 2.03,62.74 2.03,57.15 | C40.- 43.18,36.83 C50.- 75.18,38.1 v75.95,37.34 | C1.- 25.4,41.15 19.56,41.15 16.51,44.2 R4.1 12.95,47.5 RJ45.1 9.4,47.5 7.37,49.53 7.37,57.15 | 7.37,57.15 RS485TRANSCEIVER.5 | 2.03,57.15 7.37,57.15 | RN4.1 111,29.72 113.54,29.72 114.3,30.48 129.54,30.48 130.05,29.97 134.62,29.97 135.13,30.48 136.65,30.48 | 21.84,2.29 DEBUGGER.4 21.84,6.35 19.81,8.38 17.78,8.38 D2.A | 132.21,67.44 H3.B3,6 | R2.1 33.02,29.21 24.89,29.21 19.81,34.29 Q24.S
N$1
  Top 0.61: D1.C C1.+ 26.67,36.07 24.64,34.04 24.64,21.08 K1.P2
  Bottom 0.61: K1.P2 22.86,22.86 16.26,22.86 | 16.26,22.86 IC3.IN | R5.2 9.91,22.86 16.26,22.86
N$2
  Top 0.61: Q10.S Q9.S Q7.S Q8.S | Q11.S Q12.S | Q15.S Q16.S | Q13.S 70.36,50.04 70.36,59.18 Q14.S | Q6.S Q5.S | Q4.S Q3.S | Q2.S 52.58,15.75 52.58,23.62 Q1.S
  Bottom 0.61: Q15.S 53.34,48.26 68.58,48.26 Q13.S 70.87,49.53 72.14,48.26 86.36,48.26 86.49,48.39 | 86.49,48.39 Q11.S | Q9.S 104.14,48.26 86.61,48.26 86.49,48.39 | Q8.S 104.14,13.97 88.9,13.97 Q6.S 87.38,15.24 86.11,13.97 72.64,13.97 70.1,16.51 Q4.S 68.58,15.24 Q2.S | K1.S1 36.32,23.62 48.26,23.62 49.02,22.86 50.8,22.86 Q1.S
N$3
  Top 0.254: RS485TRANSCEIVER.6 10.67,52.58 RJ45.3
N$4
  Top 0.254: RS485TRANSCEIVER.7 10.67,50.04 RJ45.2
N$5
  Bottom 0.254: Q24.G 17.78,36.07 18.29,35.56 21.59,35.56 R2.2 31.75,35.56 | D38.C 53.34,39.37 38.61,39.37 37.34,38.1 34.29,38.1 31.75,35.56 | 31.75,35.56 C50.+
N$6  (via drill 0.61)
  Top 0.254: v82.3,58.67 83.82,57.15 IC1.18
  Bottom 0.254: RS485TRANSCEIVER.1 25.4,59.69 34.8,59.69 36.32,58.17 48.77,58.17 49.02,57.91 72.64,57.91 72.9,58.17 81.79,58.17 v82.3,58.67
N$7
  Top 0.254: RS485TRANSCEIVER.4 18.29,70.36 85.09,70.36 85.09,61.21 86.36,59.94 86.36,53.09 85.09,51.82 85.09,51.05 86.36,49.78 IC1.17
N$8  (via drill 0.61)
  Top 0.254: v123.95,10.16 124.97,11.18 124.97,33.53 123.7,34.8 v123.7,36.83
  Bottom 0.254: RN1.8 24.64,8.38 65.53,8.38 66.55,7.37 69.09,7.37 70.1,8.38 107.7,8.38 109.47,10.16 v123.95,10.16 | v123.7,36.83 124.97,38.1 131.57,38.1 134.62,41.15 LED17.K
N$9  (via drill 0.61)
  Top 0.254: v59.94,13.97 62.23,16.26 62.23,23.37 71.12,32.26 IC1.6
  Bottom 0.254: K1.1 54.86,13.97 55.37,14.48 59.44,14.48 v59.94,13.97
N$10
  Bottom 0.61: RJ45.4 10.67,54.1 19.05,54.1 D1.A
N$11
  Top 0.254: DEBUGGER.3 21.34,8.13 30.23,8.13 30.23,5.84 31.24,4.83 53.09,4.83 53.09,14.73 53.34,14.99 53.34,30.48 R1.1
  Bottom 0.254: R1.1 52.58,34.8 56.64,34.8 IC1.1
N$12
  Top 0.254: Q1.D 45.72,20.32 D103.C
N$13  (via drill 0.61)
  Top 0.254: v66.8,8.38 71.88,3.3 125.98,3.3 125.98,13.46 125.73,13.72 125.73,23.88 128.27,26.42 128.27,28.96 130.3,30.99 v130.3,31.24
  Bottom 0.254: RN1.5 22.35,18.29 25.15,18.29 25.65,17.78 28.19,17.78 34.04,11.94 63.25,11.94 v66.8,8.38 | v130.3,31.24 LED18.K
N$14  (via drill 0.61)
  Top 0.254: IC1.28 64.26,34.8 67.31,34.8 | 67.31,34.8 67.31,30.99 58.42,22.1 58.42,13.72 55.88,11.18 55.88,7.37 56.13,7.11 56.13,5.59 54.1,3.56 v12.95,3.56 | LED17.A 131.83,43.43 v131.83,60.2 | v69.09,53.59 66.04,50.55 66.04,46.99 67.31,45.72 67.31,34.8
  Bottom 0.254: v12.95,3.56 13.46,4.06 14.73,4.06 DEBUGGER.2 | v131.83,60.2 131.32,59.69 106.93,59.69 104.9,57.66 73.15,57.66 v69.09,53.59
N$15
  Top 0.254: Q2.D 43.69,9.4 43.18,9.4 D203.C
N$16
  Top 0.254: Q3.D 63.5,20.32 D303.C
N$17
  Top 0.254: D403.C Q4.D
N$18
  Top 0.254: Q5.D 81.28,20.32 D503.C
N$19
  Top 0.254: Q6.D 79.25,9.4 78.74,9.4 D603.C
N$20
  Top 0.254: Q7.D 99.06,20.32 D703.C
N$21
  Top 0.254: Q8.D 97.03,9.4 96.52,9.4 D803.C
N$22
  Top 0.254: Q9.D 97.03,49.53 97.03,46.23 D903.C
N$23
  Top 0.254: Q10.D 99.06,55.88 D1003.C
N$24  (via drill 0.61)
  Top 0.254: v79.5,49.53 78.74,48.77 D1103.C
  Bottom 0.254: v79.5,49.53 Q11.D
N$25
  Top 0.254: Q12.D 81.28,59.69 D1203.C
N$26  (via drill 0.61)
  Top 0.254: v45.97,46.99 58.17,34.8 60.96,34.8 IC1.2
  Bottom 0.254: R4.2 16.51,46.99 v45.97,46.99
N$27  (via drill 0.61)
  Top 0.254: IC1.4 64.01,30.99 55.37,30.99 v55.37,28.7
  Bottom 0.254: v55.37,28.7 54.1,27.43 25.65,27.43 20.07,33.02 14.73,33.02 JP1.2
N$28
  Top 0.254: R4.3 12.45,45.47 12.45,35.56 R5.1
N$38
  Top 0.254: D103.A 45.72,27.94 D101.C 40.64,20.32 40.64,13.72 36.83,9.91 EM1.TP
  Bottom 0.254: LED1.K 125.98,11.18 125.98,3.81 39.37,3.81 EM1.TP
N$39
  Top 0.254: EM2.TP 41.91,7.62 D201.C 43.18,13.97 D203.A
  Bottom 0.254: LED2.K 121.92,19.05 119.89,19.05 118.62,20.32 98.3,20.32 97.03,19.05 93.73,19.05 92.96,19.81 82.3,19.81 80.52,21.59 77.22,21.59 75.44,19.81 64.52,19.81 62.74,21.59 59.44,21.59 57.4,19.56 46.99,19.56 46.23,20.32 D203.A
N$40  (via drill 0.61)
  Top 0.254: D303.A 63.5,27.94 D301.C 55.88,20.32 55.88,14.48 56.64,13.72 56.64,12.7 54.61,10.67 EM3.TP | LED3.K 122.43,25.91 122.43,21.08 121.92,20.57 121.92,12.95 v117.86,8.89
  Bottom 0.254: v117.86,8.89 116.59,7.62 96.27,7.62 96.01,7.87 70.36,7.87 69.34,6.86 61.47,6.86 60.45,7.87 56.13,7.87 EM3.TP
N$41  (via drill 0.61)
  Top 0.254: 58.93,8.38 59.69,7.62 EM4.TP | 58.93,8.38 D401.C | LED4.K 124.46,31.75 124.46,13.72 v115.57,4.83 | D403.A 58.93,18.29 58.93,8.38
  Bottom 0.254: v115.57,4.83 61.21,4.83 EM4.TP
N$42  (via drill 0.61)
  Top 0.254: D501.C 71.12,17.78 EM5.TP | v92.96,32.26 v98.55,37.85 | v79.76,22.86 81.28,24.38 D503.A
  Bottom 0.254: LED5.K 121.67,37.85 v98.55,37.85 | v92.96,32.26 89.92,29.21 D503.A | D501.C 76.2,22.86 v79.76,22.86
N$43  (via drill 0.61)
  Top 0.254: EM6.TP 77.47,7.62 D601.C 78.74,13.97 D603.A v78.74,27.18 | LED6.K 122.43,44.96 122.43,40.13 121.92,39.62 v121.92,34.8
  Bottom 0.254: v121.92,34.8 100.58,34.8 92.96,27.18 v78.74,27.18
N$44  (via drill 0.61)
  Top 0.254: 93.98,22.86 99.06,27.94 D703.A | 93.98,22.86 D701.C | v118.87,50.55 118.87,37.85 v114.81,33.78 | EM7.TP 91.44,8.89 91.44,14.22 93.98,16.76 93.98,22.86
  Bottom 0.254: LED7.K 121.67,50.55 v118.87,50.55 | v114.81,33.78 111.51,30.48 100.33,30.48 D703.A
N$45  (via drill 0.61)
  Top 0.254: EM8.TP 95.25,7.62 D801.C 96.52,13.97 D803.A | v119.13,54.36 LED8.K | v108.97,49.53 112.27,49.53 112.27,33.27 108.71,29.72 108.71,22.1 v107.95,21.34
  Bottom 0.254: v119.13,54.36 118.62,53.85 118.36,53.85 116.59,52.07 114.05,52.07 111.51,49.53 v108.97,49.53 | v107.95,21.34 107.44,20.83 97.03,20.83 D803.A
N$46  (via drill 0.61)
  Top 0.254: D901.C 96.52,48.26 D903.A EM9.TP | LED9.K 130.81,15.24 130.81,30.48 131.32,30.99 131.32,34.8 130.81,35.31 130.81,44.7 131.32,45.21 131.32,59.44 127.25,63.5 121.67,63.5 v121.67,64.52
  Bottom 0.254: v121.67,64.52 118.87,67.31 EM9.TP
N$47  (via drill 0.61)
  Top 0.254: D1001.C 90.17,58.42 EM10.TP 95,67.31 95,68.07 95.76,68.83 99.06,68.83 D1003.A 100.58,63.5 103.63,60.45 104.65,60.45 105.16,60.96 105.66,60.96 106.68,59.94 106.68,26.42 v107.7,25.4
  Bottom 0.254: LED10.K 128.27,19.05 125.98,19.05 122.17,22.86 114.05,22.86 111.51,25.4 v107.7,25.4
N$48  (via drill 0.61)
  Top 0.254: v77.72,43.69 77.47,43.94 77.47,54.61 D1103.A EM11.TP | v132.84,28.19 133.35,28.7 133.35,49.78 132.84,50.29 v132.84,61.21
  Bottom 0.254: D1101.C 75.69,43.69 v77.72,43.69 | LED11.K 131.06,28.19 v132.84,28.19 | v132.84,61.21 130.56,63.5 101.6,63.5 99.31,65.79 80.26,65.79 EM11.TP
N$49
  Bottom 0.254: R3.1 18.03,17.78 24.89,17.78 26.16,16.51 K1.O2
N$50
  Top 0.254: K1.10 23.37,17.27 23.37,32.26 18.29,37.34 16.51,37.34 Q24.D
N$51
  Top 0.61: EMATCH-COMMON.TP 32.26,7.11 32.26,14.48 K1.O1
  Bottom 0.61: K1.S2 31.75,16.51 K1.O1
N$53  (via drill 0.61)
  Top 0.254: RS485TRANSCEIVER.3 RS485TRANSCEIVER.2 19.05,63.5 19.05,45.72 27.94,36.83 27.94,26.92 v27.43,26.42 | IC1.5 67.82,32.26 67.82,30.23 v62.74,25.15
  Bottom 0.254: v62.74,25.15 62.48,25.4 51.82,25.4 51.31,24.89 50.29,24.89 48.77,26.42 v27.43,26.42
N$54  (via drill 0.61)
  Top 0.254: v64.52,49.53 60.96,45.97 D1303.C
  Bottom 0.254: v64.52,49.53 Q13.D
N$55
  Top 0.254: Q14.D 63.5,55.88 D1403.C
N$56
  Top 0.254: Q15.D 43.18,49.53 D1503.C
N$57
  Top 0.254: Q16.D 49.53,54.36 48.51,53.34 D1603.C
N$62
  Top 0.254: D1601.C 40.64,57.15 40.64,64.52 37.85,67.31 | D1603.A 44.96,64.26 44.96,67.82 43.94,68.83 37.85,68.83 37.85,67.31 | 37.85,67.31 EM16.TP
  Bottom 0.254: LED16.K 130.3,59.18 132.08,59.18 133.86,60.96 133.86,64.01 123.44,64.01 117.6,69.85 39.37,69.85 EM16.TP
N$63  (via drill 0.61)
  Top 0.254: v135.38,29.21 136.91,30.73 136.91,58.42 131.32,64.01 122.68,64.01 122.68,64.77 121.92,65.53 120.65,65.53 LED8.A
  Bottom 0.254: RN6.9 v135.38,29.21
N$64
  Top 0.254: RN6.8 118.36,29.46 118.36,36.58 119.38,37.59 119.38,39.62 121.92,42.16 121.92,50.8 LED7.A
N$65  (via drill 0.61)
  Top 0.254: LED18.A 131.83,35.31 v131.83,21.08 | v55.63,13.46 54.36,14.73 54.36,32.77 D38.A
  Bottom 0.254: D38.A 56.39,31.24 61.72,31.24 IC1.3 | v131.83,21.08 125.98,15.24 114.05,15.24 111.51,12.7 56.39,12.7 v55.63,13.46
N$67  (via drill 0.61)
  Top 0.254: v126.75,28.19 128.27,29.72 v128.27,41.66
  Bottom 0.254: RN6.7 122.68,24.13 v126.75,28.19 | v128.27,41.66 125.48,44.45 121.92,44.45 LED6.A
N$68  (via drill 0.61)
  Top 0.254: v119.89,21.84 121.92,23.88 121.92,33.53 120.65,34.8 LED5.A
  Bottom 0.254: RN6.6 115.82,21.84 v119.89,21.84
N$69  (via drill 0.61)
  Top 0.254: v118.36,19.3 118.87,19.81 118.87,31.24 LED4.A
  Bottom 0.254: RN6.5 115.82,19.3 v118.36,19.3
N$70  (via drill 0.61)
  Top 0.254: RN6.4 117.35,18.29 v117.35,25.15
  Bottom 0.254: v117.35,25.15 118.87,26.67 LED3.A
N$71
  Top 0.254: RN6.3 120.65,19.05 LED2.A
N$72
  Bottom 0.254: RN6.2 118.11,13.97 LED1.A
N$73  (via drill 0.61)
  Top 0.254: D2.C 7.62,18.54 R3.2 11.18,22.1 11.18,33.53 19.05,41.4 v19.05,43.69 | RN3.1 24.89,47.5 24.89,56.39 25.65,57.15 29.72,57.15 29.72,60.71 29.97,60.96 29.97,64.26 RN2.1
  Bottom 0.254: v19.05,43.69 21.08,45.72 RN3.1
N$74  (via drill 0.61)
  Top 0.254: D1501.C 42.67,47.75 42.67,55.37 D1503.A 43.18,58.17 44.45,59.44 | LED15.K 128.27,53.34 128.27,58.67 v124.97,61.98 | 44.45,59.44 v45.97,60.96 | EM15.TP 44.45,66.04 44.45,59.44
  Bottom 0.254: v124.97,61.98 124.71,62.23 106.43,62.23 104.65,60.45 103.63,60.45 103.12,60.96 87.38,60.96 86.36,59.94 86.36,58.42 83.82,58.42 82.04,60.2 70.87,60.2 70.1,60.96 69.6,60.96 69.09,60.45 68.07,60.45 67.56,60.96 51.82,60.96 51.31,60.45 50.29,60.45 49.78,60.96 v45.97,60.96
N$75  (via drill 0.61)
  Top 0.254: LED9.A 128.27,12.7 133.86,12.7 133.86,33.27 135.89,35.31 135.89,45.97 133.86,48.01 v133.86,50.55
  Bottom 0.254: v133.86,50.55 127.25,57.15 116.84,57.15 RN7.2
N$76  (via drill 0.61)
  Top 0.254: v134.87,27.94 134.37,28.45 134.37,33.02 136.4,35.05 136.4,46.74 v134.87,48.26
  Bottom 0.254: LED10.A 134.62,27.94 v134.87,27.94 | v134.87,48.26 127.25,55.88 RN7.3
N$77  (via drill 0.61)
  Top 0.254: LED11.A 125.48,28.19 125.48,33.78 124.71,34.54 v124.71,39.37 | v120.9,42.42 119.38,43.94 119.38,49.78 119.89,50.29 119.89,50.8 117.35,53.34 RN7.4
  Bottom 0.254: v124.71,39.37 121.67,42.42 v120.9,42.42
N$78  (via drill 0.61)
  Top 0.254: LED12.A 125.73,34.29 v125.73,52.83
  Bottom 0.254: v125.73,52.83 125.22,53.34 118.62,53.34 116.08,50.8 RN7.5
N$79
  Bottom 0.254: RN7.6 115.82,48.01 128.78,48.01 130.81,45.97 130.81,40.64 128.27,40.64 LED13.A
N$80
  Bottom 0.254: RN7.7 116.33,46.48 119.89,46.48 120.4,46.99 125.73,46.99 LED14.A
N$81  (via drill 0.61)
  Top 0.254: RN7.8 117.86,45.47 v117.86,49.02
  Bottom 0.254: v117.86,49.02 118.36,49.53 124.46,49.53 LED15.A
N$82  (via drill 0.61)
  Top 0.254: v123.44,43.43 124.71,44.7 124.71,56.13 LED16.A
  Bottom 0.254: RN7.9 118.36,43.43 v123.44,43.43
N$83
  Top 0.254: RN6.1 113.79,10.67 113.79,59.18 RN7.1 115.57,71.37 17.02,71.37 7.62,61.98 7.62,45.21 JP1.4
N$84  (via drill 0.61)
  Top 0.254: D1301.C 60.96,48.26 D1303.A EM13.TP | LED13.K 130.3,40.13 130.3,44.96 130.81,45.47 130.81,58.67 v127,62.48
  Bottom 0.254: v127,62.48 126.49,62.99 101.35,62.99 99.06,65.28 76.45,65.28 75.95,65.79 62.48,65.79 EM13.TP
N$85  (via drill 0.61)
  Top 0.254: D1401.C 58.42,57.15 58.42,64.52 57.15,65.79 | 57.15,65.79 55.63,67.31 EM14.TP | v71.37,47.5 71.12,47.75 71.12,60.71 68.33,63.5 D1403.A 63.5,68.83 60.2,68.83 57.15,65.79
  Bottom 0.254: LED14.K 127.76,47.5 117.09,47.5 116.59,46.99 82.04,46.99 81.53,47.5 v71.37,47.5
N$86  (via drill 0.61)
  Top 0.254: 72.39,58.42 D1201.C | 72.39,61.72 EM12.TP | 72.39,58.42 72.39,61.72 | v73.91,36.83 72.39,38.35 72.39,58.42 | 72.39,61.72 v73.91,61.72
  Bottom 0.254: LED12.K 126.75,35.81 89.15,35.81 88.65,36.32 74.42,36.32 v73.91,36.83 | D1203.A 79.5,61.72 v73.91,61.72
VDD  (via drill 0.61)
  Top 0.254: IC3.OUT 12.95,23.62 12.95,4.83 13.72,4.06 24.38,4.06 DEBUGGER.5 | RS485TRANSCEIVER.8 24.38,53.09 v24.38,44.7
  Bottom 0.254: 28.96,40.13 29.72,39.37 C40.+ 37.34,39.88 50.04,39.88 R1.2 52.58,42.42 76.96,42.42 IC1.20 | 28.96,40.13 v24.38,44.7 | IC3.OUT 12.45,34.29 8.64,34.29 7.62,35.31 7.62,39.37 9.65,39.37 | 9.65,39.37 25.4,39.37 26.16,38.61 27.43,38.61 28.96,40.13 | 9.65,39.37 JP1.3

### Text on the board
Bottom: FB3 1/18/2012 (C) P. Cranwell